# EAGLE design FlowKnow (EAGLE 6.6.0)
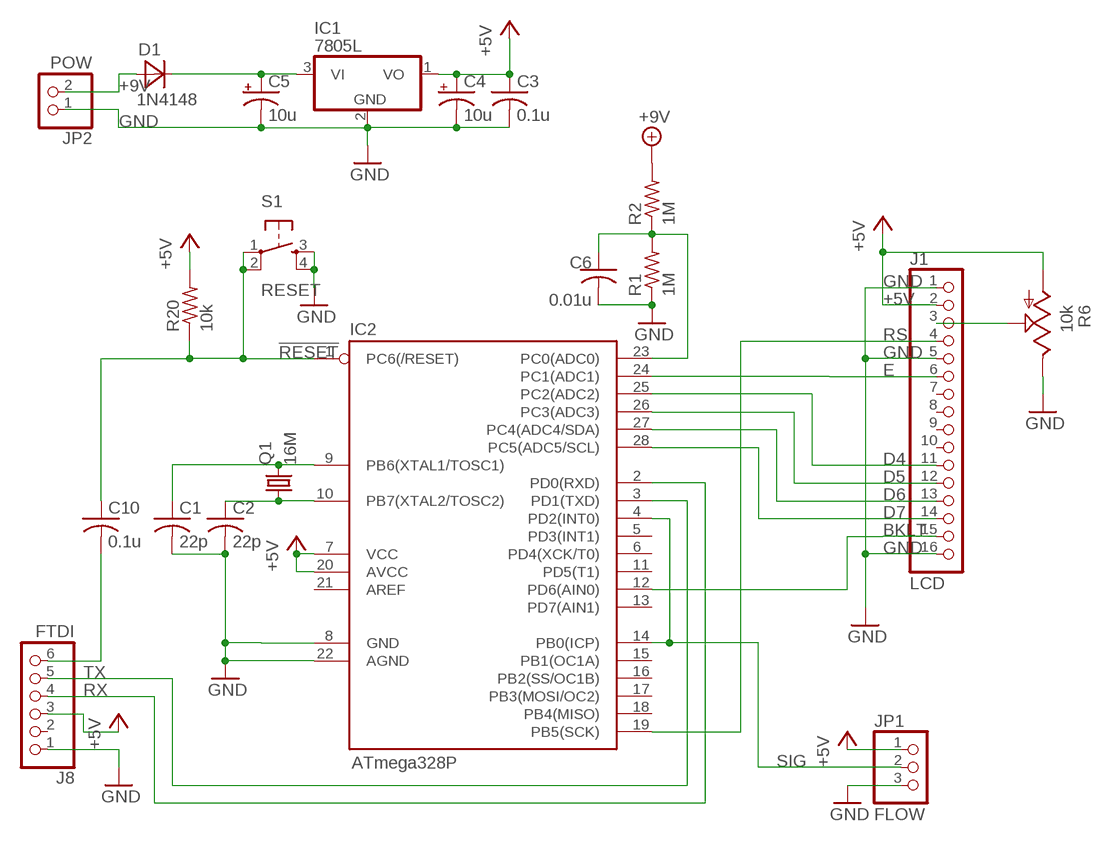
[diagram p0: schematic, sheet 1]

## Parts
C1  22p  C-US025-025X050  [C025-025X050]
C2  22p  C-US025-025X050  [C025-025X050]
C3  0.1u  C-US025-025X050  [C025-025X050]
C4  10u  CPOL-USE2-4  [E2-4]
C5  10u  CPOL-USE2.5-5  [E2,5-5]
C6  0.01u  C-US025-025X050  [C025-025X050]
C10  0.1u  C-US025-025X050  [C025-025X050]
D1  1N4148  DIODE-DO35-5  [DO35-5]
IC1  7805L  [TO92]
IC2  ATmega328P  AVR-MEGA8-PPTH  [DIL28-3]
J1  LCD  PINHD-1X16  [1X16]
J8  FTDI  PINHD-1X6/90  [1X06/90]
JP1  FLOW  PINHD-1X3/90  [1X03/90]
JP2  POW  PINHD-1X2  [1X02]
Q1  16M  CRYSTALHC49S  [HC49/S]
R1  1M  R-US_0204/7  [0204/7]
R2  1M  R-US_0204/7  [0204/7]
R6  10k  TRIM_US-CT6  [CT6]
R20  10k  R-US_0204/7  [0204/7]
S1  RESET  TAC_SWITCHPTH  [TACTILE-PTH]

## Nets
!RESET: C10.1 IC2.1(PC6(/RESET)) R20.1 S1.1 S1.2
+5V [POW]: C3.1 C4.+ IC1.1(VO) IC2.7(VCC) IC2.20(AVCC) J1.2 J8.3 JP1.1 R6.A R20.2
+9V: D1.A JP2.2 R2.2
BKLT [POW]: IC2.12(PD6(AIN0)) J1.15
D4: IC2.25(PC2(ADC2)) J1.11
D5: IC2.26(PC3(ADC3)) J1.12
D6: IC2.27(PC4(ADC4/SDA)) J1.13
D7: IC2.28(PC5(ADC5/SCL)) J1.14
E: IC2.24(PC1(ADC1)) J1.6
GND [HIGHPOW]: C1.2 C2.2 C3.2 C4.- C5.- C6.2 IC1.2(GND) IC2.8(GND) IC2.22(AGND) J1.1 J1.5 J1.16 J8.1 JP1.3 JP2.1 R1.1 R6.E S1.3 S1.4
N$1: C2.1 IC2.10(PB7(XTAL2/TOSC2)) Q1.1
N$2: C10.2 J8.6
N$3: C1.1 IC2.9(PB6(XTAL1/TOSC1)) Q1.2
N$4: J1.3 R6.S
N$6: C5.+ D1.C IC1.3(VI)
N$7: C6.1 IC2.23(PC0(ADC0)) R1.2 R2.1
RS: IC2.19(PB5(SCK)) J1.4
RX: IC2.2(PD0(RXD)) J8.4
SIG: IC2.4(PD2(INT0)) IC2.14(PB0(ICP)) JP1.2
TX: IC2.3(PD1(TXD)) J8.5
Unconnected: IC2.5(PD3(INT1)) IC2.6(PD4(XCK/T0)) IC2.11(PD5(T1)) IC2.13(PD7(AIN1)) IC2.15(PB1(OC1A)) IC2.16(PB2(SS/OC1B)) IC2.17(PB3(MOSI/OC2)) IC2.18(PB4(MISO)) IC2.21(AREF) J1.7 J1.8 J1.9 J1.10 J8.2

## Library data of the parts
C1-C3 C6 C10 = resistor:C-US: CAPACITOR, American symbol
C4 C5 = resistor:CPOL-US: POLARIZED CAPACITOR, American symbol
D1 = Bryan:DIODE-: DO41 diodes with octagon holes and no diode symbol in silk
IC1 = linear:78*: Positive VOLTAGE REGULATOR Source: http://cache.national.com/ds/LM/LM78L05.pdf http://www.fairchildsemi.com/ds/LM/LM7805.pdf
IC2 = SparkFun:AVR-MEGA8-P: MICROCONTROLLER 8 Kbytes FLASH 1 kbytes SRAM 512 bytes EEPROM USART 4-channel 10 bit ADC 2-channel 8 bit ADC
J1 = pinhead:PINHD-1X16: PIN HEADER
J8 = pinhead:PINHD-1X6: PIN HEADER
JP1 = pinhead:PINHD-1X3: PIN HEADER
JP2 = pinhead:PINHD-1X2: PIN HEADER
Q1 = crystal:CRYSTAL: CRYSTAL
R1 R2 R20 = resistor:R-US_: RESISTOR, American symbol
R6 = pot:TRIM_US-: POTENTIOMETER
S1 = SparkFun:TAC_SWITCH: Momentary Switch Button commonly used for reset or general input. Spark Fun Electronics SKU : COM-00097

## Net classes
1 POW: width 0.381 mm
2 HIGHPOW: width 0.508 mm

## Board
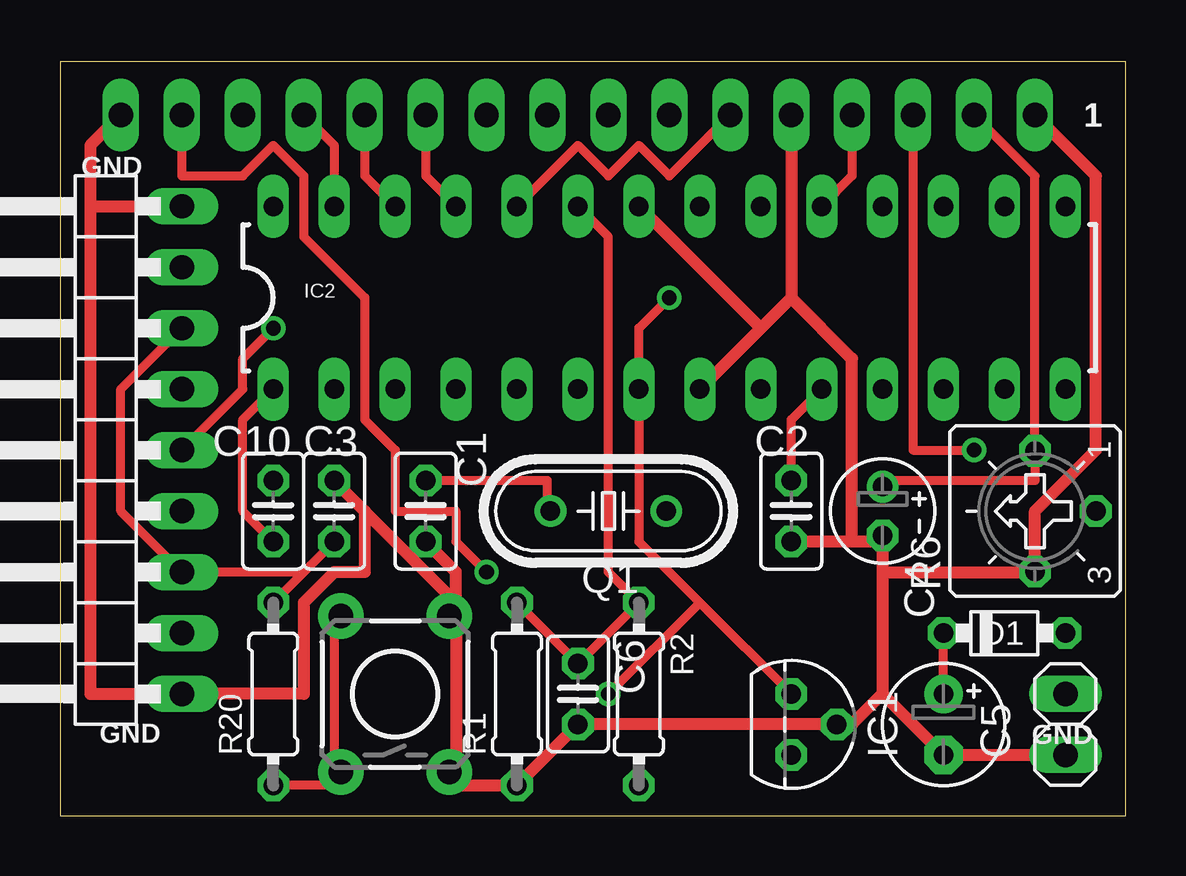
[diagram p1: board, top side]
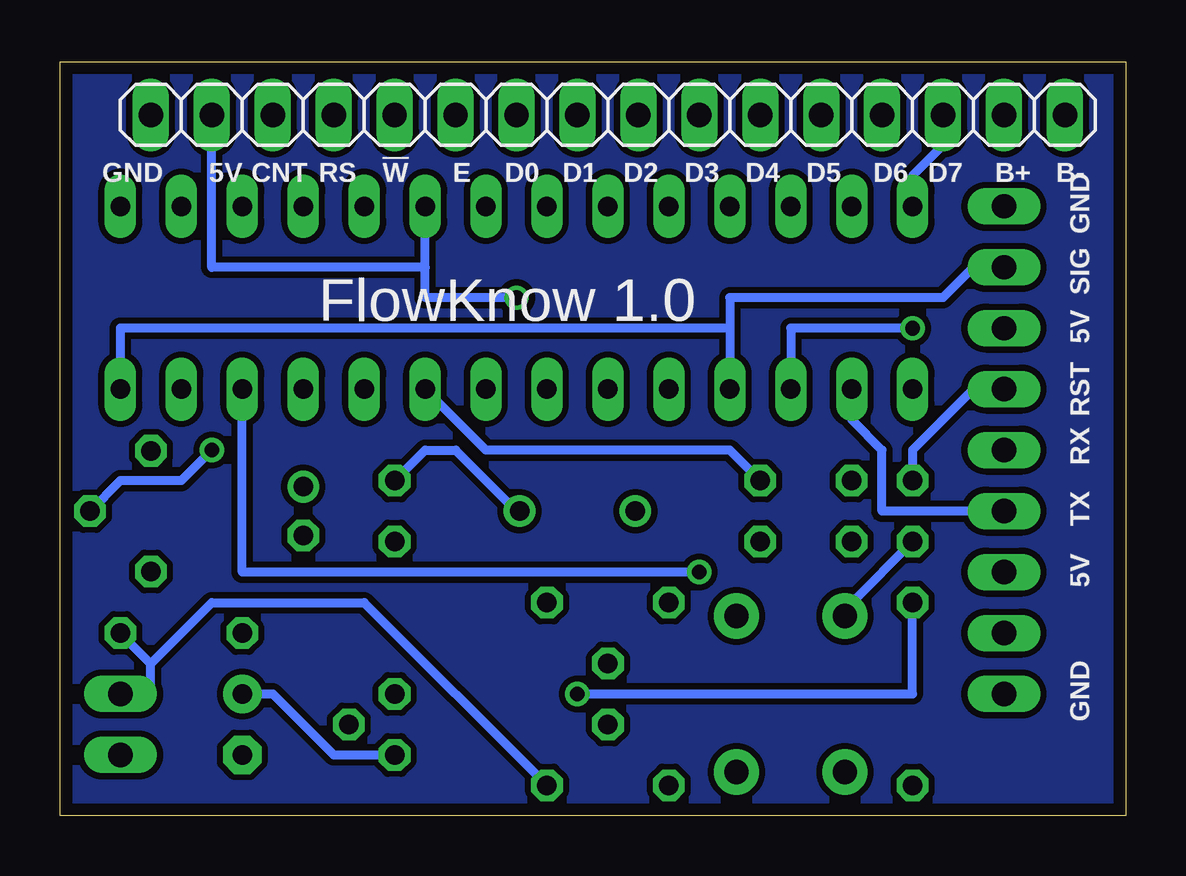
[diagram p2: board, bottom side, seen from below]

Size 44.43 x 31.42 mm. Coordinates in mm from the lower left corner, seen from the top.
Outline: 0,0 44.43,0 44.43,31.42 0,31.42 0,0
Copper layers (1*16): Top 0.035mm / dielectric 1.5mm / Bottom 0.035mm
Design rules "default *": minimum track width 15mil, minimum drill 24mil, track to track 10mil, track to pad 10mil, pad to pad 10mil, via to via 10mil, smd to smd 8mil, copper to edge 20mil, drill to drill 8mil, minimum pad ring 10mil, minimum via ring 8mil, stop-mask expansion 4mil, vias tented up to drill 24mil, thermal gap 10mil

### Footprints (pad centres in the part's own frame; a part is rotated, then mirrored left to right if it is on the bottom)
C025-025X050 = drill 0.813 octagon: 1 -1.27,0; 2 1.27,0
E2-4 = drill 0.813 pad 1.27: + -1.016,0 | drill 0.813 pad 1.27 octagon: - 1.016,0
E2,5-5 = drill 0.813 pad 1.6: + -1.27,0 | drill 0.813 pad 1.6 octagon: - 1.27,0
DO35-5 = drill 0.813 octagon: A 2.54,0; C -2.54,0
TO92 = drill 0.813 octagon: 1 -1.27,0; 2 0,1.905; 3 1.27,0
DIL28-3 = drill 0.813 long: 1 -16.51,-3.81; 2 -13.97,-3.81; 3 -11.43,-3.81; 4 -8.89,-3.81; 5 -6.35,-3.81; 6 -3.81,-3.81; 7 -1.27,-3.81; 8 1.27,-3.81; 9 3.81,-3.81; 10 6.35,-3.81; 11 8.89,-3.81; 12 11.43,-3.81; 13 13.97,-3.81; 14 16.51,-3.81; 15 16.51,3.81; 16 13.97,3.81; 17 11.43,3.81; 18 8.89,3.81; 19 6.35,3.81; 20 3.81,3.81; 21 1.27,3.81; 22 -1.27,3.81; 23 -3.81,3.81; 24 -6.35,3.81; 25 -8.89,3.81; 26 -11.43,3.81; 27 -13.97,3.81; 28 -16.51,3.81
1X16 = drill 1.016 long: 1 -19.05,0; 2 -16.51,0; 3 -13.97,0; 4 -11.43,0; 5 -8.89,0; 6 -6.35,0; 7 -3.81,0; 8 -1.27,0; 9 1.27,0; 10 3.81,0; 11 6.35,0; 12 8.89,0; 13 11.43,0; 14 13.97,0; 15 16.51,0; 16 19.05,0
1X06/90 = drill 1.016 long: 1 -6.35,-3.81; 2 -3.81,-3.81; 3 -1.27,-3.81; 4 1.27,-3.81; 5 3.81,-3.81; 6 6.35,-3.81
1X03/90 = drill 1.016 long: 1 -2.54,-3.81; 2 0,-3.81; 3 2.54,-3.81
1X02 = drill 1.016 long: 1 -1.27,0; 2 1.27,0
HC49/S = drill 0.813: 1 -2.413,0; 2 2.413,0
0204/7 = drill 0.813 octagon: 1 -3.81,0; 2 3.81,0
CT6 = drill 0.813 octagon: A 2.515,0; E -2.515,0; S 0,-2.54
TACTILE-PTH = drill 1.016 pad 1.88: 1 -3.251,2.261; 2 3.251,2.261; 3 -3.251,-2.261; 4 3.251,-2.261

### Placement (x,y rotation side)
C1  15.24,12.7 270 top
C2  30.48,12.7 270 top
C3  11.43,12.7 90 top
C4  34.29,12.7 270 top
C5  36.83,3.81 270 top
C6  21.59,5.08 270 top
C10  8.89,12.7 90 top
D1  39.37,7.62 0 top
IC1  30.48,3.81 270 top
IC2  25.4,21.59 0 top
J1  21.59,29.21 0 bottom
J8  1.27,11.43 90 top
JP1  1.27,22.86 90 top
JP2  41.91,3.81 90 top
Q1  22.86,12.7 180 top
R1  19.05,5.08 90 top
R2  24.13,5.08 270 top
R6  40.64,12.7 90 top
R20  8.89,5.08 90 top
S1  13.97,5.08 90 top

### Tracks (layer width: path | path; a pad name or v marks a point on that pad's centre or on a via)
!RESET
  Top 0.381: R20.1 11.43,1.27 S1.1 11.43,2.54 11.43,7.62 S1.2 | IC2.1 7.62,16.51 7.62,12.7 C10.1
  Bottom 0.381: C10.1 11.43,8.89 S1.2
+5V  (via drill 0.61)
  Top 0.381: 40.64,15.24 R6.A | R6.A 40.64,13.97 34.29,13.97 C4.+ | 40.64,15.24 R6.A | J1.2 40.64,26.67 40.64,15.24 | 40.64,15.24 R6.A | C3.1 10.16,10.16 | 10.16,10.16 R20.2 | 10.16,10.16 J8.3 2.54,12.7 2.54,17.78 JP1.1 | 26.67,8.89 24.13,11.43 IC2.7 24.13,20.32 v25.4,21.59 | 26.67,8.89 IC1.1 | 26.67,8.89 v22.86,5.08
  Bottom 0.381: 29.21,22.86 29.21,21.59 v25.4,21.59 | 29.21,22.86 IC2.20 | R20.2 8.89,5.08 v22.86,5.08 | J1.2 38.1,22.86 29.21,22.86
+9V
  Bottom 0.381: R2.2 31.75,8.89 38.1,8.89 40.64,6.35 | 40.64,6.35 40.64,5.08 JP2.2 | 40.64,6.35 D1.A
BKLT  (via drill 0.61)
  Top 0.381: v17.78,10.16 16.51,11.43 16.51,12.7 13.97,12.7 13.97,15.24 12.7,16.51 12.7,21.59 10.16,24.13 10.16,26.67 8.89,27.94 7.62,26.67 5.08,26.67 J1.15
  Bottom 0.381: IC2.12 36.83,10.16 v17.78,10.16
D4
  Top 0.381: IC2.25 15.24,26.67 J1.11
D5
  Top 0.381: IC2.26 12.7,26.67 J1.12
D6
  Top 0.381: IC2.27 11.43,27.94 J1.13
D7
  Bottom 0.381: IC2.28 8.89,26.67 7.62,27.94 J1.14
E
  Top 0.381: IC2.24 21.59,27.94 22.86,26.67 24.13,27.94 25.4,26.67 J1.6
GND
  Top 0.508: 1.27,25.4 1.27,27.94 J1.16 | 1.27,25.4 1.27,5.08 J8.1 10.16,5.08 10.16,8.89 11.43,10.16 12.7,10.16 12.7,12.7 | 1.27,25.4 JP1.3 | C1.2 16.51,10.16 16.51,8.89 | 16.51,8.89 S1.4 | 16.51,8.89 12.7,12.7 | 12.7,12.7 C3.2 | 16.51,8.89 S1.4 | S1.4 16.51,7.62 16.51,2.54 S1.3 16.51,1.27 R1.1 C6.2 31.75,3.81 IC1.2 33.02,3.81 34.29,5.08 | 30.48,21.59 29.21,20.32 | 29.21,20.32 IC2.8 | J1.5 30.48,21.59 | 29.21,20.32 IC2.22 | JP2.1 C5.- 34.29,5.08 | 34.29,11.43 34.29,10.16 | 34.29,10.16 34.29,5.08 | 34.29,11.43 C4.- 34.29,11.43 | 34.29,10.16 40.64,10.16 | 40.64,10.16 R6.E | 34.29,11.43 33.02,11.43 | 33.02,11.43 C2.2 | J1.1 43.18,26.67 43.18,15.24 40.64,12.7 R6.E | 40.64,10.16 R6.E | 40.64,10.16 R6.E | 30.48,21.59 33.02,19.05 33.02,11.43
N$1
  Top 0.381: IC2.10 30.48,16.51 C2.1
  Bottom 0.381: C2.1 29.21,15.24 27.94,15.24 25.4,12.7 Q1.1
N$2
  Bottom 0.381: C10.2 8.89,15.24 6.35,17.78 J8.6
N$3
  Top 0.381: C1.1 20.32,13.97 20.32,12.7 Q1.2
  Bottom 0.381: IC2.9 26.67,15.24 16.51,15.24 C1.1
N$4  (via drill 0.61)
  Top 0.381: v38.1,15.24 35.56,15.24 J1.3
  Bottom 0.381: R6.S 41.91,13.97 39.37,13.97 v38.1,15.24
N$6
  Top 0.381: C5.+ D1.C
  Bottom 0.381: IC1.3 33.02,2.54 35.56,5.08 C5.+
N$7
  Top 0.381: R1.2 C6.1 R2.1 22.86,10.16 22.86,24.13 IC2.23
N$9
  pour Bottom: 0,0 0,31.75 44.45,31.75 44.45,0
RS
  Top 0.381: IC2.19 33.02,26.67 J1.4
RX
  Bottom 0.381: IC2.2 11.43,16.51 10.16,15.24 10.16,12.7 J8.4
SIG
  Bottom 0.381: 16.51,20.32 16.51,21.59 7.62,21.59 6.35,22.86 JP1.2 | 16.51,20.32 IC2.4 | IC2.14 41.91,20.32 16.51,20.32
TX  (via drill 0.61)
  Top 0.381: v8.89,20.32 7.62,19.05 7.62,17.78 J8.5
  Bottom 0.381: IC2.3 13.97,20.32 v8.89,20.32

### Text on the board
_tsilk: 1 | GND | GND | GND
_bsilk: B- | B+ | D7 | D6 | D5 | D4 | D3 | D2 | D1 | D0 | E | !W | RS | CNT | 5V | GND | GND | SIG | FlowKnow 1.0 | 5V | RST | RX | TX | 5V | GND